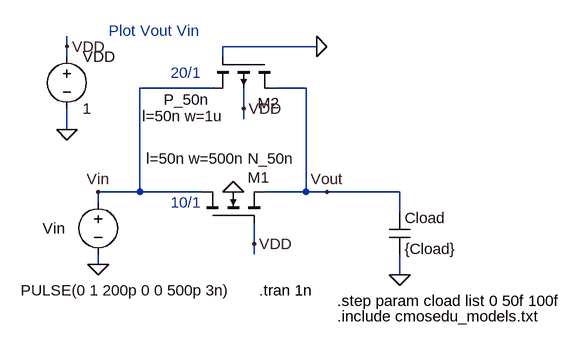
[diagram p0: schematic Fig13_3_varying_load.asc]
Fig13_3_varying_load.asc, the LTspice schematic file:
Version 4
SHEET 1 1136 680
WIRE 160 -336 160 -352
WIRE 544 -336 400 -336
WIRE 160 -320 160 -336
WIRE 400 -320 400 -336
WIRE 384 -272 272 -272
WIRE 528 -272 480 -272
WIRE 432 -240 432 -272
WIRE 432 -224 432 -240
WIRE 160 -208 160 -240
WIRE 272 -112 272 -272
WIRE 272 -112 208 -112
WIRE 368 -112 272 -112
WIRE 528 -112 528 -272
WIRE 528 -112 464 -112
WIRE 560 -112 528 -112
WIRE 672 -112 560 -112
WIRE 208 -96 208 -112
WIRE 672 -80 672 -112
WIRE 448 -32 448 -64
WIRE 448 -16 448 -32
WIRE 208 0 208 -16
WIRE 672 16 672 -16
FLAG 208 0 0
FLAG 672 16 0
FLAG 560 -112 Vout
FLAG 208 -112 Vin
FLAG 416 -112 0
FLAG 160 -208 0
FLAG 160 -336 VDD
FLAG 448 -32 VDD
FLAG 544 -336 0
FLAG 432 -240 VDD
SYMBOL nmos4 368 -64 R270
WINDOW 0 70 70 VRight 0
WINDOW 3 99 70 VRight 0
WINDOW 123 99 -86 VRight 0
SYMATTR InstName M1
SYMATTR Value N_50n
SYMATTR Value2 l=50n w=500n
SYMBOL voltage 208 -112 R0
WINDOW 0 -85 56 Left 0
WINDOW 3 -119 152 Left 0
WINDOW 123 0 0 Left 0
WINDOW 39 0 0 Left 0
SYMATTR InstName Vin
SYMATTR Value PULSE(0 1 200p 0 0 500p 3n)
SYMBOL cap 656 -80 R0
SYMATTR InstName Cload
SYMATTR Value {Cload}
SYMBOL voltage 160 -336 R0
WINDOW 123 0 0 Left 0
WINDOW 39 0 0 Left 0
SYMATTR InstName VDD
SYMATTR Value 1
SYMBOL pmos4 480 -320 R90
WINDOW 0 71 -7 VRight 0
WINDOW 3 66 101 VRight 0
WINDOW 123 91 79 VRight 0
SYMATTR InstName M2
SYMATTR Value P_50n
SYMATTR Value2 l=50n w=1u
TEXT 456 40 Left 0 !.tran 1n
TEXT 576 80 Left 0 !.include cmosedu_models.txt
TEXT 224 -360 Left 0 ;Plot Vout Vin
TEXT 320 -296 Left 0 ;20/1
TEXT 320 -96 Left 0 ;10/1
TEXT 576 56 Left 0 !.step param cload list 0 50f 100f

The netlist it stands for:
* Fig13_3_varying_load.asc
M1 Vin VDD Vout 0 N_50n l=50n w=500n
Vin Vin 0 PULSE(0 1 200p 0 0 500p 3n)
Cload Vout 0 {Cload}
VDD VDD 0 1
M2 Vout 0 Vin VDD P_50n l=50n w=1u
.model NMOS NMOS
.model PMOS PMOS
.lib standard.mos
.tran 1n
.include cmosedu_models.txt
* Plot Vout Vin
* 20/1
* 10/1
.step param cload list 0 50f 100f
.backanno
.end